# Altium schematic sheet BLOCK DIAGRAM.SchDoc: BLOCK DIAGRAM
size A4; DrawnBy: Lucas Church; DocumentNumber: N/A; Revision: A; SheetNumber: 1; SheetTotal: 6
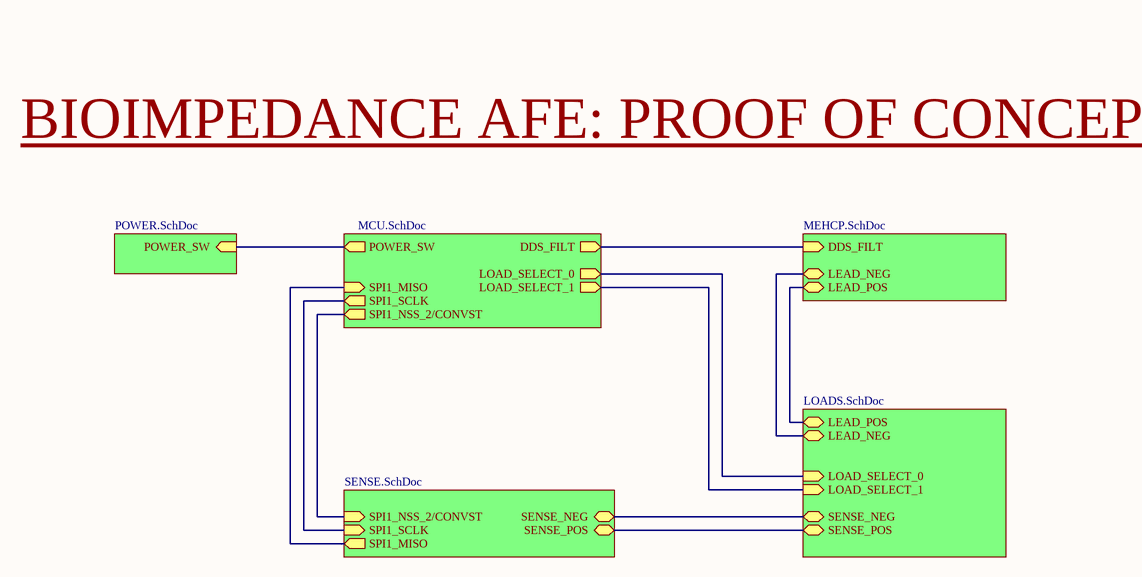
[diagram p0: BLOCK DIAGRAM.SchDoc]

## Sub-sheets
U_LOADS = LOADS.SchDoc: LOAD_SELECT_1 (in), LOAD_SELECT_0 (in), SENSE_NEG (bidir), SENSE_POS (bidir), LEAD_NEG (bidir), LEAD_POS (bidir)
U_MCU = MCU.SchDoc: SPI1_SCLK (out), SPI1_MISO (in), LOAD_SELECT_1 (out), LOAD_SELECT_0 (out), SPI1_NSS_2/CONVST (out), DDS_FILT (out), POWER_SW (out)
U_MEHCP = MEHCP.SchDoc: DDS_FILT (in), LEAD_NEG (bidir), LEAD_POS (bidir)
U_POWER = POWER.SchDoc: POWER_SW (in)
U_SENSE = SENSE.SchDoc: SPI1_SCLK (in), SPI1_NSS_2/CONVST (in), SPI1_MISO (out), SENSE_NEG (bidir), SENSE_POS (bidir)

## Nets
(unnamed): sheet U_LOADS/LOAD_SELECT_1, sheet U_MCU/LOAD_SELECT_1
(unnamed): sheet U_LOADS/LOAD_SELECT_0, sheet U_MCU/LOAD_SELECT_0
(unnamed): sheet U_LOADS/SENSE_NEG, sheet U_SENSE/SENSE_NEG
(unnamed): sheet U_LOADS/SENSE_POS, sheet U_SENSE/SENSE_POS
(unnamed): sheet U_LOADS/LEAD_NEG, sheet U_MEHCP/LEAD_NEG
(unnamed): sheet U_LOADS/LEAD_POS, sheet U_MEHCP/LEAD_POS
(unnamed): sheet U_MCU/SPI1_SCLK, sheet U_SENSE/SPI1_SCLK
(unnamed): sheet U_MCU/SPI1_MISO, sheet U_SENSE/SPI1_MISO
(unnamed): sheet U_MCU/SPI1_NSS_2/CONVST, sheet U_SENSE/SPI1_NSS_2/CONVST
(unnamed): sheet U_MCU/DDS_FILT, sheet U_MEHCP/DDS_FILT
(unnamed): sheet U_MCU/POWER_SW, sheet U_POWER/POWER_SW

## Notes on the sheet
- BIOIMPEDANCE AFE: PROOF OF CONCEPT